# Altium schematic sheet YA-N-Sensors.SchDoc: Yet Another IoT Node - Sensors
size A4; Revision: 2.0; SheetNumber: 5; SheetTotal: 5
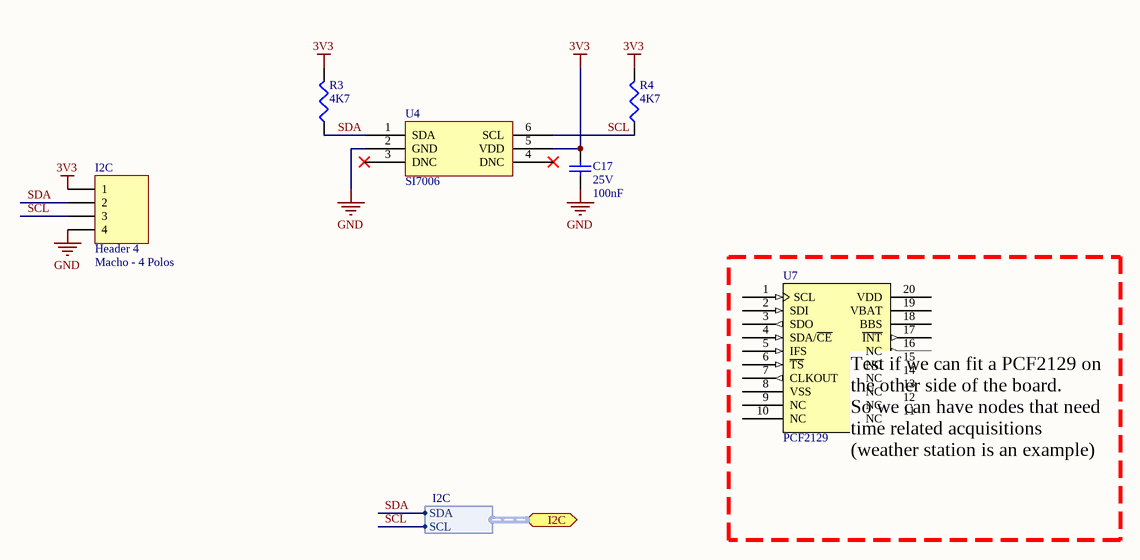
[diagram p0: YA-N-Sensors.SchDoc]

## Parts
C17  value 100nF  Tensão: 25V  [CC0603]  (hidden comment: Capacitor Cerâmico)
I2C  Header 4  value Macho - 4 Polos  [CONN HDR1X4]
R3  value 4K7  [CC0603]  (hidden comment: Resistor)
R4  value 4K7  [CC0603]  (hidden comment: Resistor)
U4  SI7006  [QFN3x3-6P]
U7  PCF2129  [SOIC-20N_WIDE]

## Ports
I2C (harness I2C)

## Harnesses
I2C: SDA, SCL

## Nets
3V3: C17.2 I2C.1 R3.2 R4.2 U4.5(VDD)
GND: C17.1 I2C.4 U4.2(GND)
SCL: I2C.3 R4.1 U4.6(SCL) ; port I2C.SCL
SDA: I2C.2 R3.1 U4.1(SDA) ; port I2C.SDA

Not connected (* = marked no-connect by the designer): U4 3(DNC)* 4(DNC)*; U7 1(SCL) 2(SDI) 3(SDO) 4(SDA/~{CE}) 5(IFS) 6(~{TS}) 7(CLKOUT) 8(VSS) 9(NC) 10(NC) 11(NC) 12(NC) 13(NC) 14(NC) 15(NC) 16(NC) 17(~{INT}) 18(BBS) 19(VBAT) 20(VDD)

## Notes on the sheet
- (near U7) Test if we can fit a PCF2129 on the other side of the board.
  So we can have nodes that need time related acquisitions (weather station is an example)
- Projeto:
- Tamanho:
- Data:
- A4
- Eng. Felipe Navarro
- Hora:
- Revisão:
- Folha
- de
- Arquivo:

## Library data of the parts
C17 = Cap 100nF 25V 0603 X7R: Capacitor (Semiconductor SIM Model); Chinês: Local; ChinesePrice: 0,00246; Corrente: *A; Potência: *W; Obs:: X7R; Tolerância: ±10%; Supplier 1: Digi-Key; Supplier Part Number 1: 490-1524-1-ND; ComponentLink1Description: Datasheet; ComponentLink1URL: D:\Tecnoclade\Datasheet\!DataMissing.pdf
I2C = Header 4: Header, 4-Pin; ChinesePrice: 0,10000; Chinês: Proved - Local; Obs:: Barra de 40 pinos - ATENÇÃO; Corrente: *; Potência: *; Supplier 1: Digi-Key; Supplier Part Number 1: A26509-40-ND; Tensão: *; Tolerância: *; ComponentLink1Description: Datasheet; ComponentLink1URL: D:\Tecnoclade\Datasheet\!DataMissing.pdf
R3 R4 = Res 4K7 1% 0603 1/10W: ChinesePrice: 0,00000; Chinês: ----; Corrente: *A; Potência: 1/10W; Tensão: *V; Obs: ±100ppm/ºC; Tolerância: ±1%; Supplier 1: Digi-Key; Supplier Part Number 1: RMCF0603FT4K70CT-ND; ComponentLink1Description: Datasheet; ComponentLink1URL: D:\Tecnoclade\Datasheet\!DataMissing.pdf
U4 = SI7006: SI7021-A20-GM1; ChinesePrice: 0,00000; Chinês: ----; Corrente: *; Potência: *; Tensão: *; Value: *; Supplier 1: Digi-Key; Supplier Part Number 1: 336-3141-ND; Obs:: *; Tolerância: *; ComponentLink1Description: Datasheet; ComponentLink1URL: https://www.silabs.com/Support%20Documents%2FTechnicalDocs%2FSi7006-A20.pdf
U7 = PCF2129: Accurate RTC with integrated quartz crystal for industrial applications; ChinesePrice: 0,00000; Chinês: ----; Corrente: *; Potência: *; Supplier 1: Digi-Key; Supplier Part Number 1: 568-9817-1-ND; Tensão: *; Value: *; Obs:: *; Tolerância: *; ComponentLink1Description: Datasheet; ComponentLink1URL: D:\Tecnoclade\Datasheet\